# EAGLE design KSUnia_zasilanie (EAGLE 5.04)
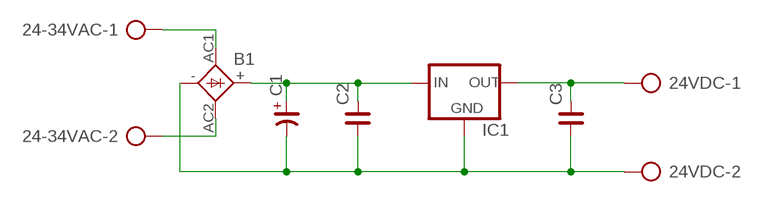
[diagram p0: schematic, sheet 1]

## Parts
24-34VAC  AK500/2  [AK500/2]
24VDC  AK500/2  [AK500/2]
B1  2KBP  [2KBP]
C1  CP_E-075X180  [CE-075X180]
C2  C_1206  [C1206]
C3  C_1206  [C1206]
IC1  V_REG_78XXSINK  [TO220-IGO]

## Nets
N$1: 24-34VAC.1 B1.AC1
N$2: 24-34VAC.2 B1.AC2
N$3: B1.+ C1.+ C2.2 IC1.IN
N$4: 24VDC.1 C3.2 IC1.OUT
N$5: 24VDC.2 B1.- C1.- C2.1 C3.1 IC1.GND

## Library data of the parts
24-34VAC 24VDC = con-ptr500:AK500/2: CONNECTOR
B1 = rectifier:2KBP: RECTIFIER grid 3 x 3,81 mm
C1 = rc-master:CP_: POLARIZED CAP
C2 C3 = rc-master:C_: NON-POLARIZED CAP
IC1 = SparkFun:V_REG_78XX: Voltage Regulator Standard 7805 5V regulator. IGO (Input Ground Output). Spark Fun Electronics SKU : COM-00107

## Board
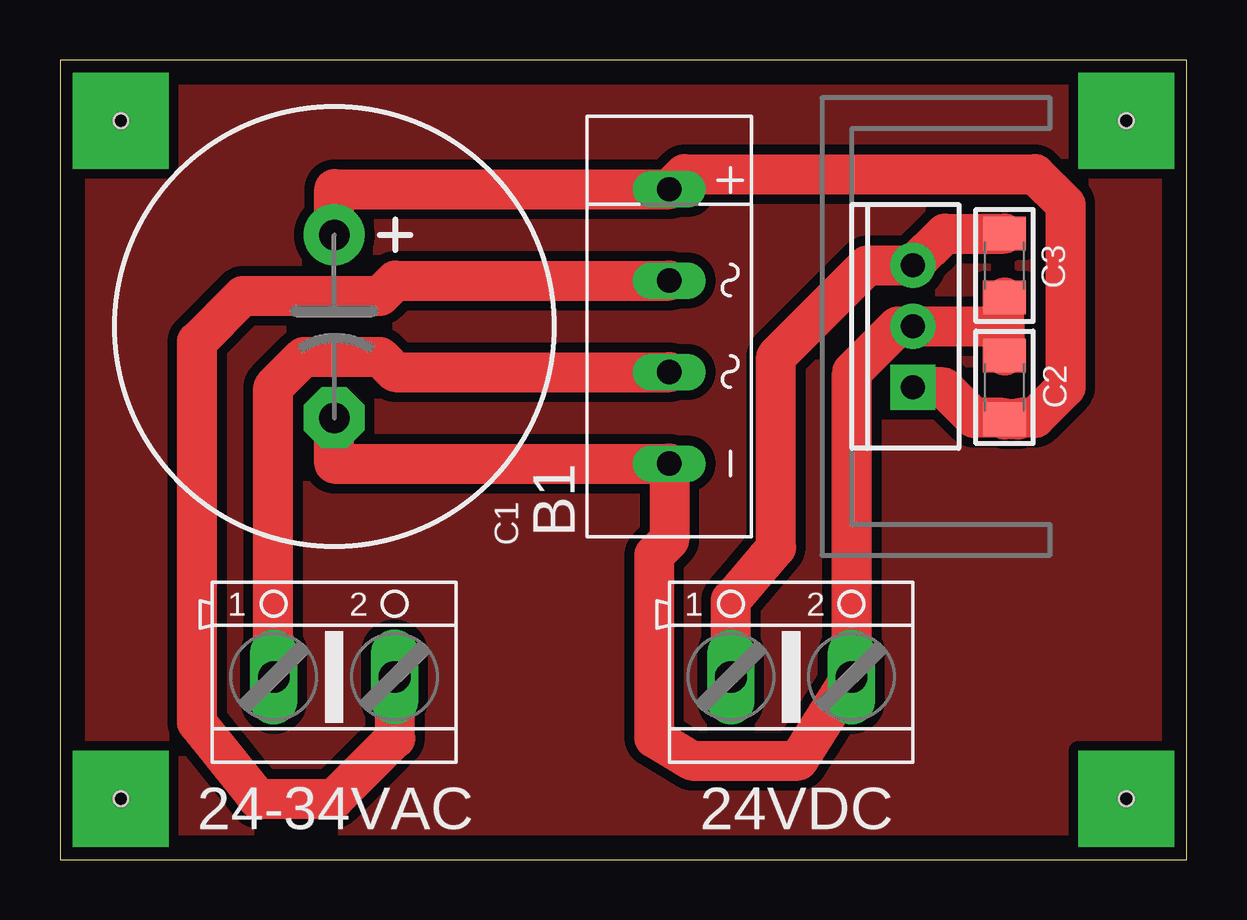
[diagram p1: board, top side]

Size 46.97 x 33.33 mm. Coordinates in mm from the lower left corner, seen from the top.
Outline: 0,0 46.97,0 46.97,33.33 0,33.33 0,0
Copper layers (1*16): Top 0.035mm / dielectric 1.5mm / Bottom 0.035mm
Design rules "default": minimum track width 10mil, minimum drill 0.6mm, track to track 8mil, track to pad 8mil, pad to pad 8mil, via to via 8mil, smd to smd 8mil, copper to edge 40mil, drill to drill 8mil, minimum pad ring 10mil, minimum via ring 8mil, stop-mask expansion 4mil, vias tented up to drill 0mil, thermal gap 10mil
Holes 0.6 mm at 2.54,2.54 44.45,2.54 44.45,30.8 2.54,30.8

### Footprints (pad centres in the part's own frame; a part is rotated, then mirrored left to right if it is on the bottom)
AK500/2 = drill 1.321 long: 1 -2.515,0; 2 2.515,0
2KBP = drill 1.016 long: + 5.715,0; - -5.715,0; AC1 -1.905,0; AC2 1.905,0
CE-075X180 = drill 1.27 pad 2.54 round: + -3.81,0 | drill 1.27 pad 2.54 octagon: - 3.81,0
C1206 = smd 1.4 x 1.8: 1 -1.329,0; 2 1.329,0
TO220-IGO = drill 1 pad 1.88 round: GND 0,0; OUT 2.54,0 | drill 1 pad 1.88 square: IN -2.54,0

### Placement (x,y rotation side)
24-34VAC  11.43,7.62 0 top
24VDC  30.48,7.62 0 top
B1  25.4,22.23 90 top
C1  11.43,22.23 270 top
C2  39.37,19.68 270 top
C3  39.37,24.77 90 top
IC1  35.56,22.23 90 top

### Tracks (layer width: path | path; a pad name or v marks a point on that pad's centre or on a via)
N$1
  Top 1.676: B1.AC1 13.97,20.32 13.34,20.95 10.16,20.95 8.89,19.68 8.89,9.23 24-34VAC.1
N$2
  Top 1.676: B1.AC2 13.97,24.13 13.34,23.5 7.62,23.5 5.71,21.59 5.71,5.71 8.26,2.54 11.43,2.54 13.97,5.08 13.97,5.05 24-34VAC.2
N$3
  Top 1.676: C1.+ 11.43,27.94 B1.+ 26.04,28.57 40.64,28.57 41.91,27.3 41.91,19.68 40.64,18.41 40.01,18.41 39.95,18.36 C2.2 39.31,18.41 38.1,18.41 36.83,19.68 IC1.IN
N$4
  Top 1.676: C3.2 36.89,26.09 IC1.OUT 33.66,24.77 29.84,20.95 29.84,13.02 27.96,10.82 24VDC.1
N$5  (1 unrouted)
  Top 1.676: C1.- 11.43,16.51 B1.- 25.4,13.34 24.77,12.7 24.77,12.06 24.77,5.08 26.35,4.13 30.77,4.13 24VDC.2 | 39.37,22.23 IC1.GND 34.92,22.23 33.02,20.32 33.02,7.62 | 39.37,22.23 C3.1 | 39.37,22.23 C2.1
N$6  (via drill 0.5 pad 4)
  other vias: 2.54,2.54
N$7  (via drill 0.5 pad 4)
  other vias: 44.45,2.54
N$8  (via drill 0.5 pad 4)
  other vias: 44.45,30.8
N$9  (via drill 0.5 pad 4)
  other vias: 2.54,30.8
N$10
  pour Top (isolate 0.406): 0,33.34 0,0 46.99,0 46.99,33.34

### Text on the board
Document: + | -